# Altium schematic sheet Sheet3.SchDoc
size 381 x 241 mm; SheetNumber: 2; SheetTotal: 3
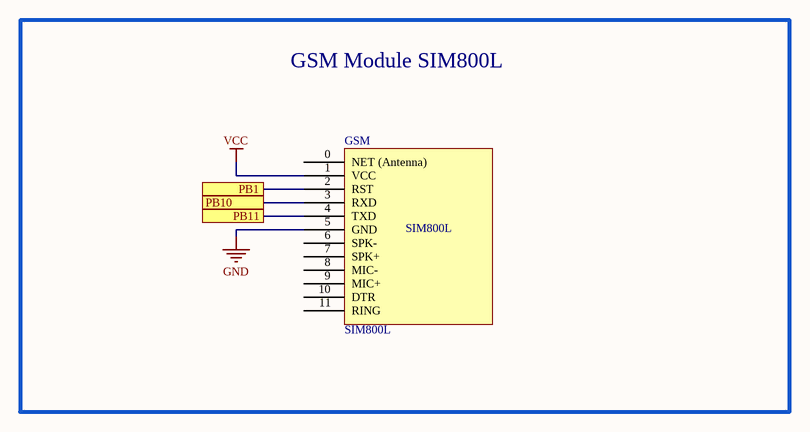
[diagram p0: Sheet3.SchDoc]

## Parts
GSM  SIM800L  [SIM800L]

## Blocks framed on the sheet
GSM Module SIM800L: GSM

## Ports
PB1, PB10, PB11

## Nets
GND: GSM.5(GND)
VCC: GSM.1(VCC)
PB1: GSM.2(RST) ; port PB1
PB10: GSM.3(RXD) ; port PB10
PB11: GSM.4(TXD) ; port PB11

Not connected (* = marked no-connect by the designer): GSM 0(NET_(Antenna)) 6(SPK-) 7(SPK+) 8(MIC-) 9(MIC+) 10(DTR) 11(RING)